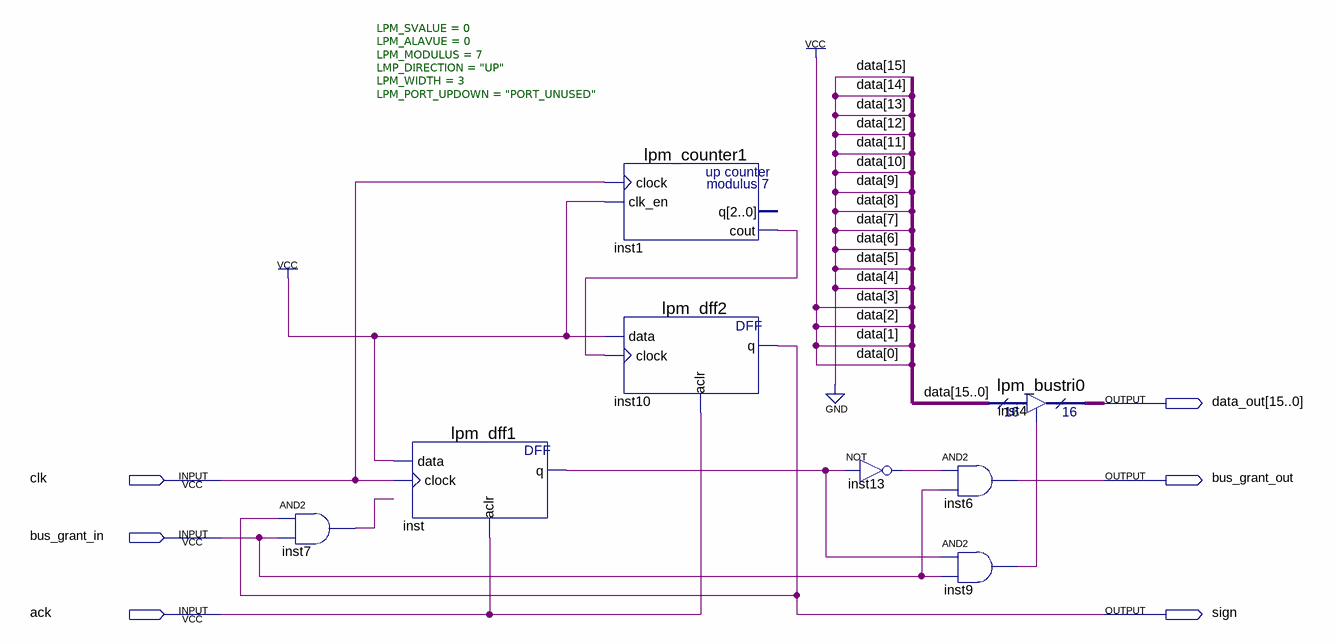
[diagram p0: schematic sheet]
// Quartus schematic master_block_3.bdf as structural Verilog: 8 symbols, 6 pins
module master_block_3 (
  input  clk,
  input  bus_grant_in,
  input  ack,
  output [15:0] data_out,
  output bus_grant_out,
  output sign
);

  wire inst1_cout, inst7_out, inst9_out, inst13_out, inst_q;

  and inst7 (inst7_out, sign, bus_grant_in);
  lpm_dff1 inst (.data(1'b1), .clock(clk), .aclr(ack), .q(inst_q));
  lpm_counter1 #(.LPM_SVALUE(0), .LPM_ALAVUE(0), .LPM_MODULUS(7), .LMP_DIRECTION("UP"), .LPM_WIDTH(3), .LPM_PORT_UPDOWN("PORT_UNUSED")) inst1 (
    .clock(clk), .clk_en(1'b1), .cout(inst1_cout));  // open: q
  lpm_dff2 inst10 (.data(1'b1), .clock(inst1_cout), .aclr(ack), .q(sign));
  not inst13 (inst13_out, inst_q);
  lpm_bustri0 inst4 (.enabledt(inst9_out), .data(16'b0000000000001111), .tridata(data_out));
  and inst6 (bus_grant_out, inst13_out, bus_grant_in);
  and inst9 (inst9_out, inst_q, bus_grant_in);
endmodule
